# Altium schematic sheet TOP.SchDoc
size A
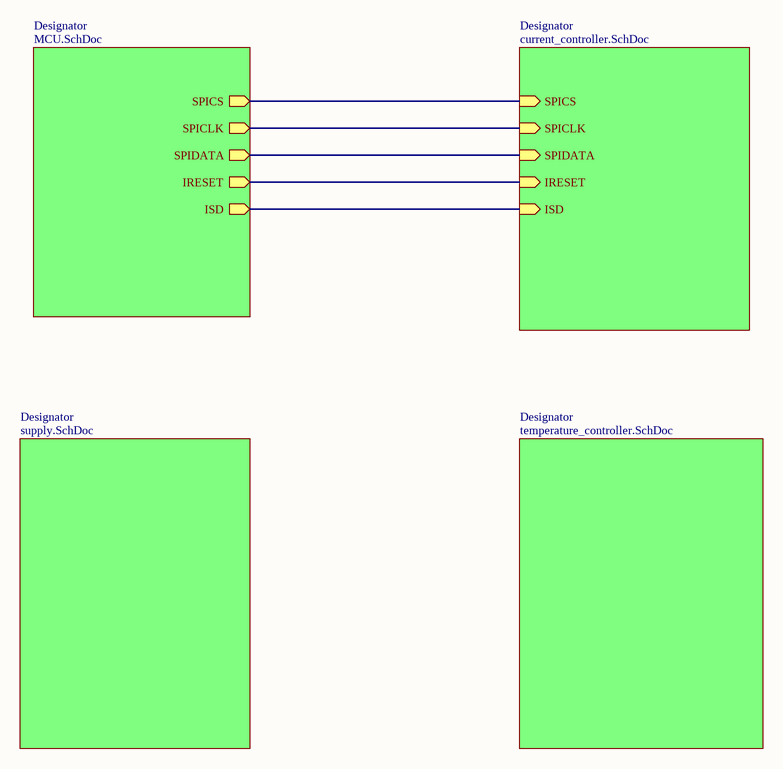
[diagram p0: TOP.SchDoc]

## Sub-sheets
Designator = MCU.SchDoc: SPICS (out), SPICLK (out), SPIDATA (out), IRESET (out), ISD (out)
Designator = current_controller.SchDoc: SPICS (in), SPICLK (in), SPIDATA (in), IRESET (in), ISD (in)
Designator = supply.SchDoc: no entries
Designator = temperature_controller.SchDoc: no entries

## Nets
(unnamed): sheet Designator/SPICS, sheet Designator/SPICS
(unnamed): sheet Designator/SPICLK, sheet Designator/SPICLK
(unnamed): sheet Designator/SPIDATA, sheet Designator/SPIDATA
(unnamed): sheet Designator/IRESET, sheet Designator/IRESET
(unnamed): sheet Designator/ISD, sheet Designator/ISD